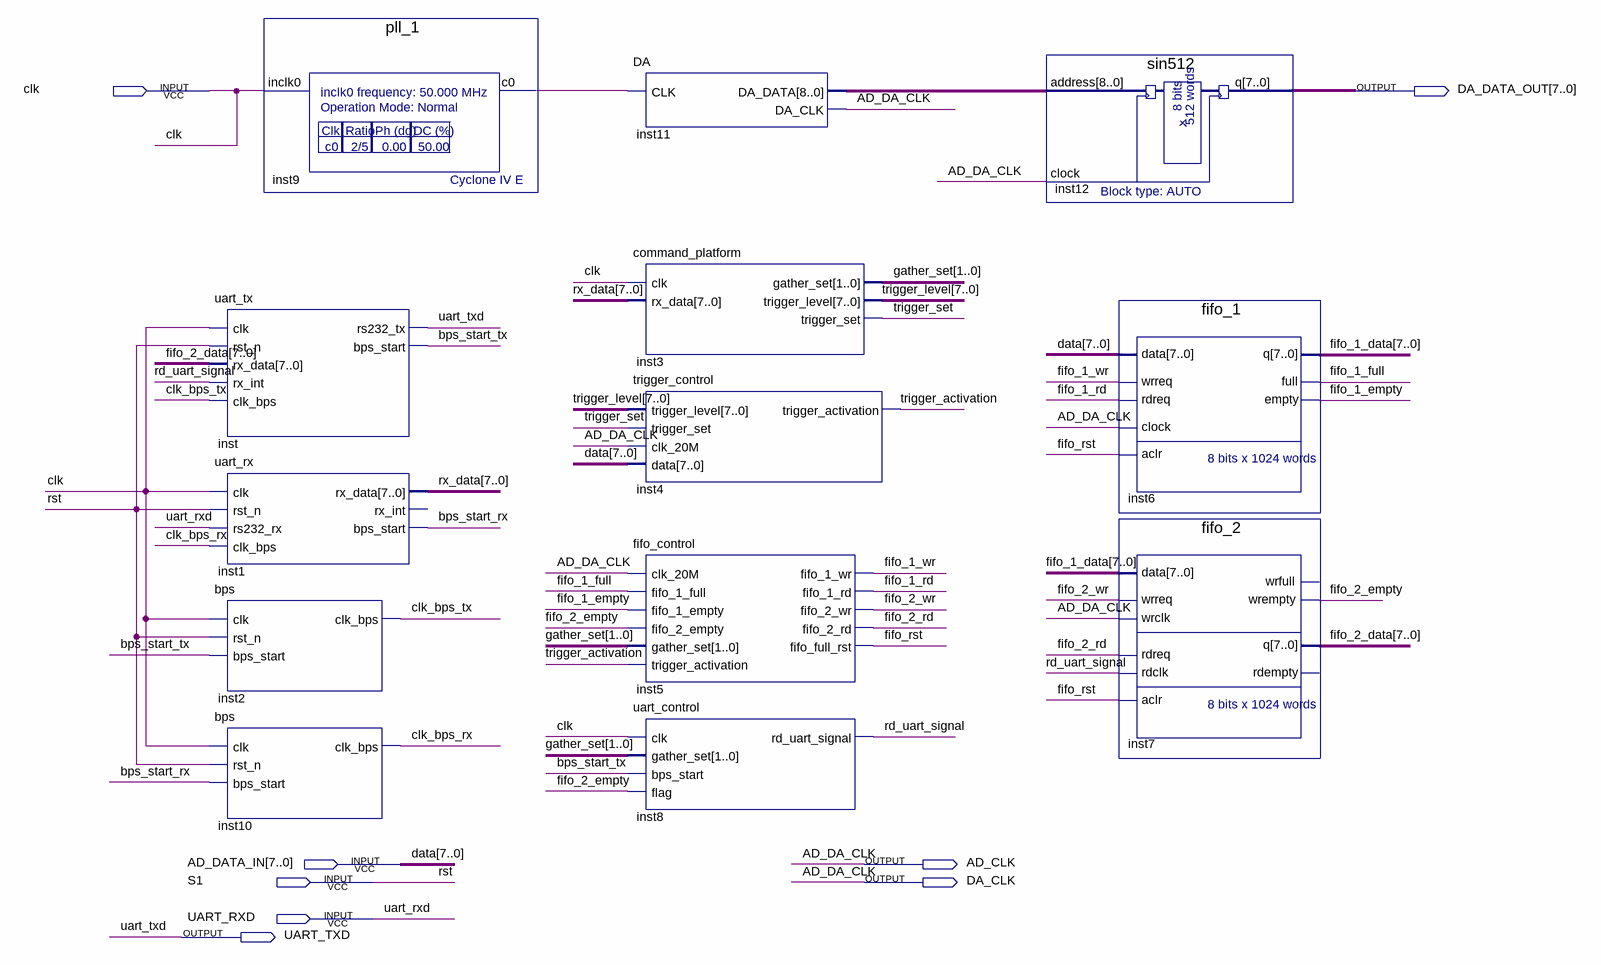
[diagram p0: schematic sheet]
// Quartus schematic osc.bdf as structural Verilog: 13 symbols, 8 pins
module osc (
  input  clk,
  input  [7:0] AD_DATA_IN,
  input  S1,
  input  UART_RXD,
  output [7:0] DA_DATA_OUT,
  output AD_CLK,
  output DA_CLK,
  output UART_TXD
);

  wire bps_start_rx, bps_start_tx, clk_bps_rx, clk_bps_tx, fifo_1_empty, fifo_1_full, fifo_1_rd, fifo_1_wr,
       fifo_2_empty, fifo_2_rd, fifo_2_wr, fifo_rst, inst9_c0, rd_uart_signal, trigger_activation,
       trigger_set;
  wire [1:0] gather_set;
  wire [7:0] fifo_1_data, fifo_2_data, rx_data, trigger_level;
  wire [8:0] inst11_da_data;

  uart_tx inst (
    .clk(clk), .rst_n(S1), .rx_data(fifo_2_data), .rx_int(rd_uart_signal), .clk_bps(clk_bps_tx),
    .rs232_tx(UART_TXD), .bps_start(bps_start_tx));
  uart_rx inst1 (
    .clk(clk), .rst_n(S1), .rs232_rx(UART_RXD), .clk_bps(clk_bps_rx), .rx_data(rx_data),
    .bps_start(bps_start_rx));  // open: rx_int
  bps inst2 (.clk(clk), .rst_n(S1), .bps_start(bps_start_tx), .clk_bps(clk_bps_tx));
  bps inst10 (.clk(clk), .rst_n(S1), .bps_start(bps_start_rx), .clk_bps(clk_bps_rx));
  pll_1 inst9 (.inclk0(clk), .c0(inst9_c0));
  DA inst11 (.CLK(inst9_c0), .DA_DATA(inst11_da_data), .DA_CLK(AD_CLK));
  command_platform inst3 (
    .clk(clk), .rx_data(rx_data), .gather_set(gather_set), .trigger_level(trigger_level),
    .trigger_set(trigger_set));
  trigger_control inst4 (
    .trigger_level(trigger_level), .trigger_set(trigger_set), .clk_20M(AD_CLK), .data(AD_DATA_IN),
    .trigger_activation(trigger_activation));
  fifo_control inst5 (
    .clk_20M(AD_CLK), .fifo_1_full(fifo_1_full), .fifo_1_empty(fifo_1_empty), .fifo_2_empty(fifo_2_empty),
    .gather_set(gather_set), .trigger_activation(trigger_activation), .fifo_1_wr(fifo_1_wr),
    .fifo_1_rd(fifo_1_rd), .fifo_2_wr(fifo_2_wr), .fifo_2_rd(fifo_2_rd), .fifo_full_rst(fifo_rst));
  uart_control inst8 (
    .clk(clk), .gather_set(gather_set), .bps_start(bps_start_tx), .flag(fifo_2_empty),
    .rd_uart_signal(rd_uart_signal));
  sin512 inst12 (.address(inst11_da_data), .clock(AD_CLK), .q(DA_DATA_OUT));
  fifo_1 inst6 (
    .data(AD_DATA_IN), .wrreq(fifo_1_wr), .rdreq(fifo_1_rd), .clock(AD_CLK), .aclr(fifo_rst),
    .q(fifo_1_data), .full(fifo_1_full), .empty(fifo_1_empty));
  fifo_2 inst7 (
    .data(fifo_1_data), .wrreq(fifo_2_wr), .wrclk(AD_CLK), .rdreq(fifo_2_rd), .rdclk(rd_uart_signal),
    .aclr(fifo_rst), .wrempty(fifo_2_empty), .q(fifo_2_data));  // open: wrfull, rdempty

  assign DA_CLK = AD_CLK;

  // Other names for the same wires on the sheet: AD_DA_CLK = AD_CLK; data[7:0] = AD_DATA_IN; rst = S1
endmodule
